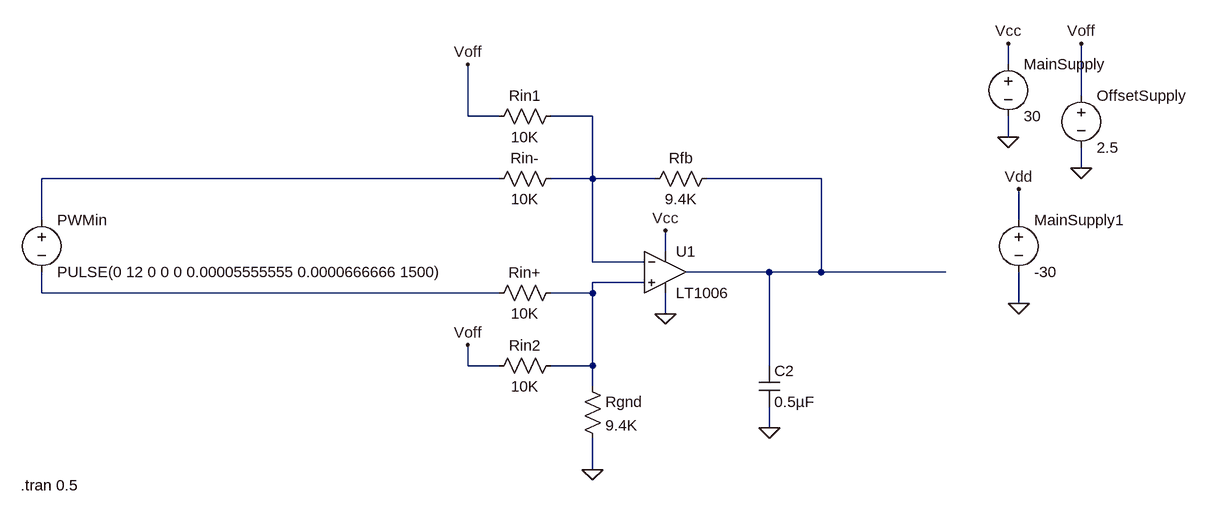
[diagram p0: schematic RoboSim PWM Input Filter V2.asc]
RoboSim PWM Input Filter V2.asc, the LTspice schematic file:
Version 4
SHEET 1 1140 680
WIRE 832 -144 832 -176
WIRE 944 -96 944 -176
WIRE 0 -64 0 -144
WIRE 48 -64 0 -64
WIRE 192 -64 128 -64
WIRE 832 -32 832 -64
WIRE 944 16 944 -16
WIRE 48 32 -656 32
WIRE 192 32 192 -64
WIRE 192 32 128 32
WIRE 288 32 192 32
WIRE 544 32 368 32
WIRE -656 96 -656 32
WIRE 848 96 848 48
WIRE 304 144 304 112
WIRE 192 160 192 32
WIRE 272 160 192 160
WIRE 464 176 336 176
WIRE 544 176 544 32
WIRE 544 176 464 176
WIRE 736 176 544 176
WIRE 272 192 192 192
WIRE -656 208 -656 176
WIRE 48 208 -656 208
WIRE 192 208 192 192
WIRE 192 208 128 208
WIRE 848 224 848 176
WIRE 304 240 304 208
WIRE 0 320 0 288
WIRE 48 320 0 320
WIRE 192 320 192 208
WIRE 192 320 128 320
WIRE 464 320 464 176
WIRE 192 352 192 320
WIRE 464 416 464 384
WIRE 192 480 192 432
FLAG 304 112 Vcc
FLAG 304 240 0
FLAG 192 480 0
FLAG 832 -32 0
FLAG 944 16 0
FLAG 832 -176 Vcc
FLAG 944 -176 Voff
FLAG 848 48 Vdd
FLAG 848 224 0
FLAG 0 -144 Voff
FLAG 0 288 Voff
FLAG 464 416 0
SYMBOL Opamps\\LT1006 304 112 R0
SYMATTR InstName U1
SYMBOL res 144 16 R90
WINDOW 0 0 56 VBottom 2
WINDOW 3 32 56 VTop 2
SYMATTR InstName Rin-
SYMATTR Value 10K
SYMBOL res 144 192 R90
WINDOW 0 0 56 VBottom 2
WINDOW 3 32 56 VTop 2
SYMATTR InstName Rin+
SYMATTR Value 10K
SYMBOL res 384 16 R90
WINDOW 0 0 56 VBottom 2
WINDOW 3 32 56 VTop 2
SYMATTR InstName Rfb
SYMATTR Value 9.4K
SYMBOL res 176 336 R0
SYMATTR InstName Rgnd
SYMATTR Value 9.4K
SYMBOL voltage -656 80 R0
WINDOW 123 0 0 Left 2
WINDOW 39 0 0 Left 2
SYMATTR InstName PWMin
SYMATTR Value PULSE(0 12 0 0 0 0.00005555555 0.0000666666 1500)
SYMBOL voltage 832 -160 R0
WINDOW 123 0 0 Left 2
WINDOW 39 0 0 Left 2
SYMATTR InstName MainSupply
SYMATTR Value 30
SYMBOL voltage 944 -112 R0
WINDOW 123 0 0 Left 2
WINDOW 39 0 0 Left 2
SYMATTR InstName OffsetSupply
SYMATTR Value 2.5
SYMBOL voltage 848 80 R0
WINDOW 123 0 0 Left 2
WINDOW 39 0 0 Left 2
SYMATTR InstName MainSupply1
SYMATTR Value -30
SYMBOL res 144 -80 R90
WINDOW 0 0 56 VBottom 2
WINDOW 3 32 56 VTop 2
SYMATTR InstName Rin1
SYMATTR Value 10K
SYMBOL res 144 304 R90
WINDOW 0 0 56 VBottom 2
WINDOW 3 32 56 VTop 2
SYMATTR InstName Rin2
SYMATTR Value 10K
SYMBOL cap 448 320 R0
SYMATTR InstName C2
SYMATTR Value 0.5µF
TEXT -688 504 Left 2 !.tran 0.5

The netlist it stands for:
* RoboSim PWM Input Filter V2.asc
XU1 N004 N001 Vcc 0 N003 LT1006  ; pins In+ In- V+ V- OUT
Rin- N001 N002 10K
Rin+ N004 N005 10K
Rfb N003 N001 9.4K
Rgnd N004 0 9.4K
V§PWMin N002 N005 PULSE(0 12 0 0 0 0.00005555555 0.0000666666 1500)
V§MainSupply Vcc 0 30
V§OffsetSupply Voff 0 2.5
V§MainSupply1 Vdd 0 -30
Rin1 N001 Voff 10K
Rin2 N004 Voff 10K
C2 N003 0 0.5µF
.tran 0.5
.lib LTC.lib
.backanno
.end